# EAGLE design 4ChannelAnalyzer (EAGLE 6.6.0)

## Sheet 1 of 2
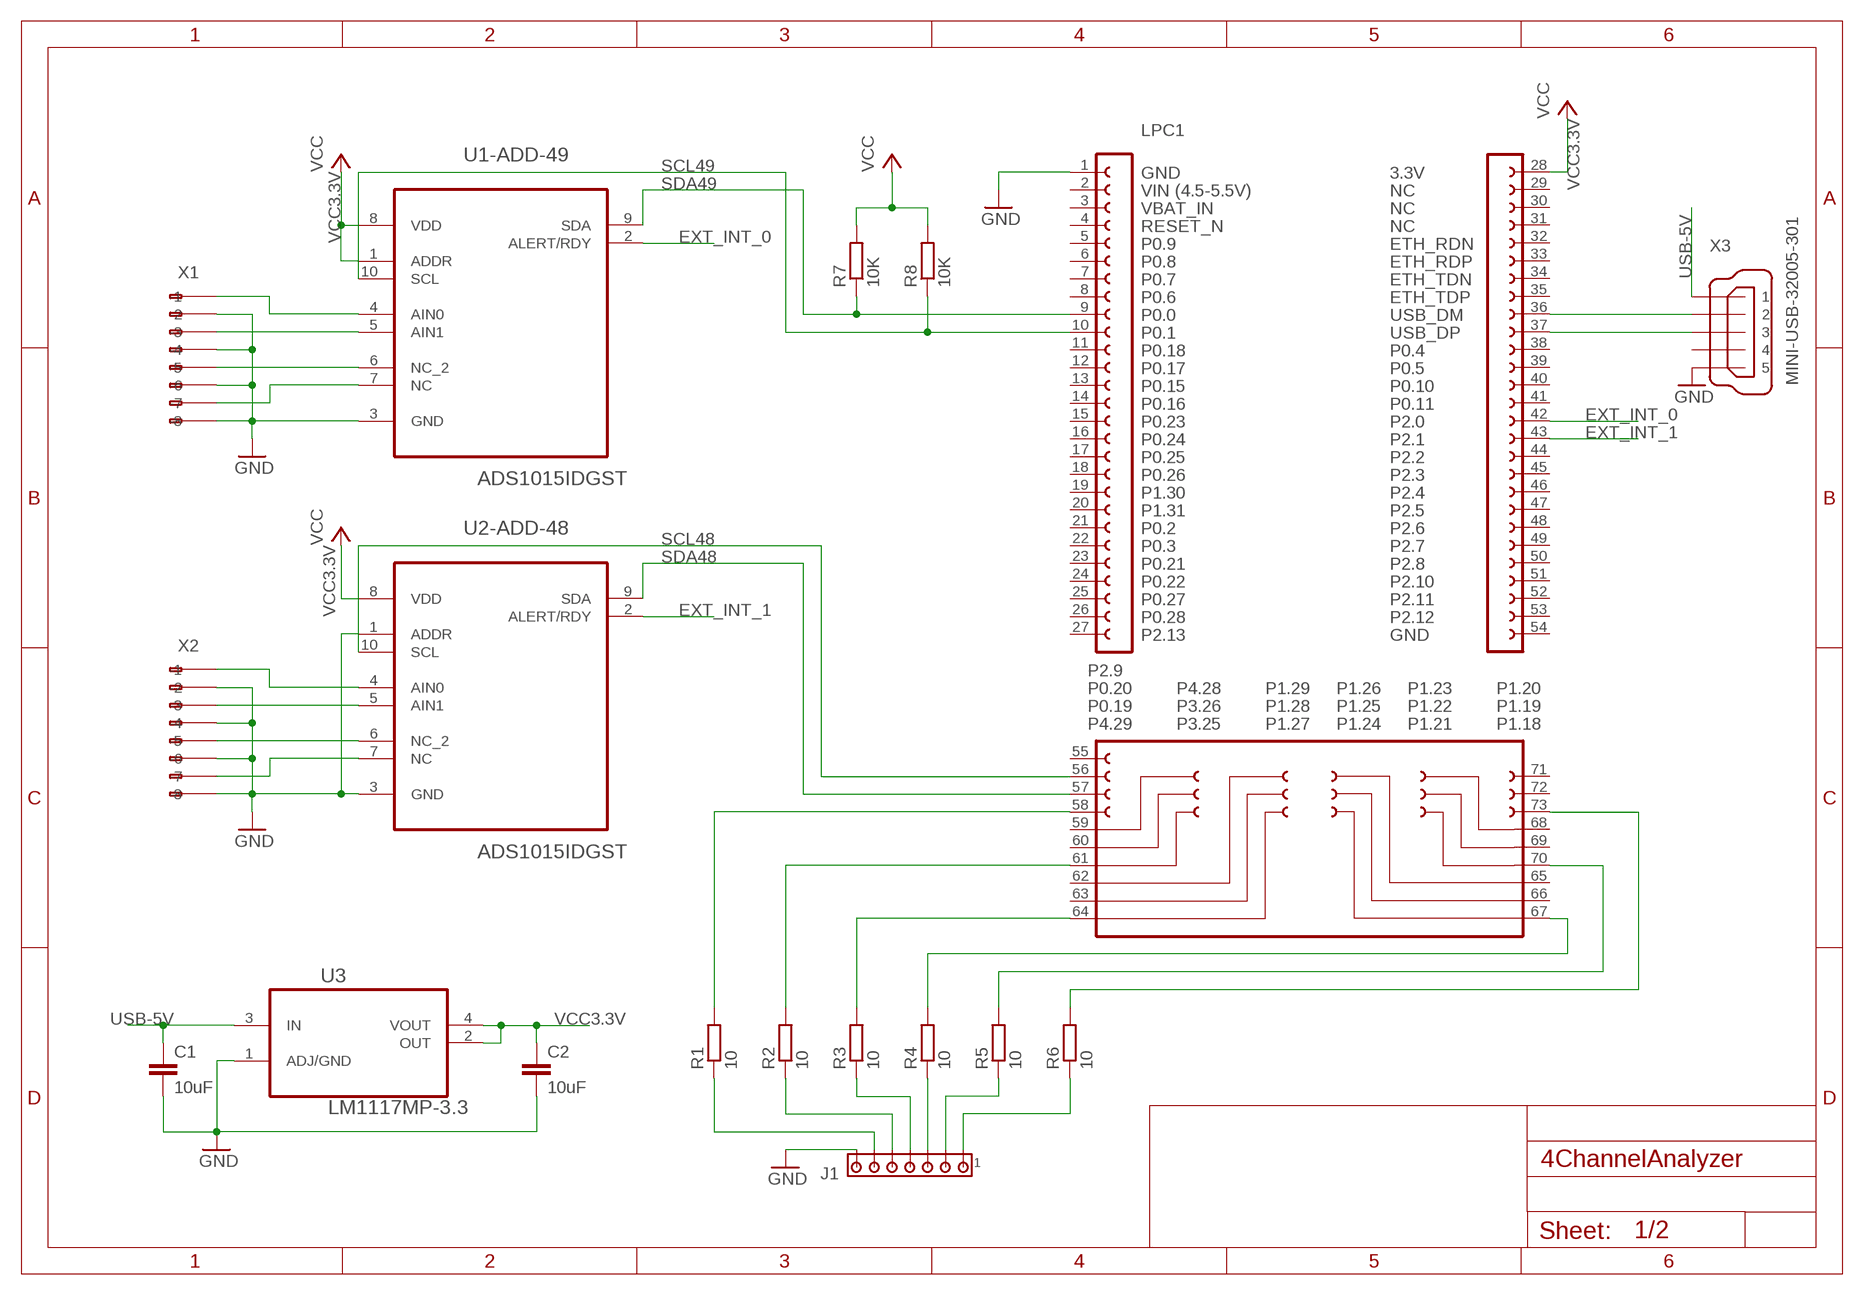
[diagram p0: schematic, sheet 1]

### Parts
C1  10uF  C-EUC0805  [C0805]
C2  10uF  C-EUC0805  [C0805]
J1  MTA07-100  [10X07MTA]
LPC1  LPCXPRESSO_LPC1769  [LPCXPRESSO_LPC1769]
R1  10  R-EU_M2012  [M2012]
R2  10  R-EU_M2012  [M2012]
R3  10  R-EU_M2012  [M2012]
R4  10  R-EU_M2012  [M2012]
R5  10  R-EU_M2012  [M2012]
R6  10  R-EU_M2012  [M2012]
R7  10K  R-EU_M0805  [M0805]
R8  10K  R-EU_M0805  [M0805]
U1-ADD-49  ADS1015IDGST  [SOP50P490X110-10N]
U2-ADD-48  ADS1015IDGST  [SOP50P490X110-10N]
U3  LM1117MP-3.3  [SOT230P696X180-4N]
X1  233-108  [233-108]
X2  233-108  [233-108]
X3  MINI-USB-32005-301  [32005-301]

### Nets
EXT_INT_0: LPC1.42 U1-ADD-49.2(ALERT/RDY)
EXT_INT_1: LPC1.43 U2-ADD-48.2(ALERT/RDY)
GND: C1.2 C2.2 J1.7 LPC1.1 U1-ADD-49.3(GND) U2-ADD-48.1(ADDR) U2-ADD-48.3(GND) U3.1(ADJ/GND) X1.A2(-2) X1.A4(-4) X1.A6(-6) X1.A8(-8) X2.A2(-2) X2.A4(-4) X2.A6(-6) X2.A8(-8) X3.5
N$1: U1-ADD-49.4(AIN0) X1.A1(-1)
N$2: J1.6 R1.1
N$3: J1.5 R2.1
N$4: J1.4 R3.1
N$5: J1.3 R4.1
N$6: J1.2 R5.1
N$7: J1.1 R6.1
N$8: U1-ADD-49.5(AIN1) X1.A3(-3)
N$9: U2-ADD-48.4(AIN0) X2.A1(-1)
N$10: U2-ADD-48.5(AIN1) X2.A3(-3)
N$11: U2-ADD-48.6(NC_2) X2.A5(-5)
N$12: U2-ADD-48.7(NC) X2.A7(-7)
N$13: U1-ADD-49.6(NC_2) X1.A5(-5)
N$14: U1-ADD-49.7(NC) X1.A7(-7)
N$19: LPC1.36 X3.2
N$20: LPC1.37 X3.3
N$21: LPC1.58 R1.2
N$22: LPC1.61 R2.2
N$23: LPC1.64 R3.2
N$24: LPC1.67 R4.2
N$25: LPC1.70 R5.2
N$26: LPC1.73 R6.2
SCL48: LPC1.56 U2-ADD-48.10(SCL)
SCL49: LPC1.10 R8.1 U1-ADD-49.10(SCL)
SDA48: LPC1.57 U2-ADD-48.9(SDA)
SDA49: LPC1.9 R7.1 U1-ADD-49.9(SDA)
USB-5V: C1.1 U3.3(IN) X3.1
VCC3.3V: C2.1 LPC1.28 R7.2 R8.2 U1-ADD-49.1(ADDR) U1-ADD-49.8(VDD) U2-ADD-48.8(VDD) U3.2(OUT) U3.4(VOUT) ; supply symbol labelled VCC
Unconnected: LPC1.2 LPC1.3 LPC1.4 LPC1.5 LPC1.6 LPC1.7 LPC1.8 LPC1.11 LPC1.12 LPC1.13 LPC1.14 LPC1.15 LPC1.16 LPC1.17 LPC1.18 LPC1.19 LPC1.20 LPC1.21 LPC1.22 LPC1.23 LPC1.24 LPC1.25 LPC1.26 LPC1.27 LPC1.29 LPC1.30 LPC1.31 LPC1.32 LPC1.33 LPC1.34 LPC1.35 LPC1.38 LPC1.39 LPC1.40 LPC1.41 LPC1.44 LPC1.45 LPC1.46 LPC1.47 LPC1.48 LPC1.49 LPC1.50 LPC1.51 LPC1.52 LPC1.53 LPC1.54 LPC1.55 LPC1.59 LPC1.60 LPC1.62 LPC1.63 LPC1.65 LPC1.66 LPC1.68 LPC1.69 LPC1.71 LPC1.72 X1.B1(B-1) X1.B2(B-2) X1.B3(B-3) X1.B4(B-4) X1.B5(B-5) X1.B6(B-6) X1.B7(B-7) X1.B8(B-8) X2.B1(B-1) X2.B2(B-2) X2.B3(B-3) X2.B4(B-4) X2.B5(B-5) X2.B6(B-6) X2.B7(B-7) X2.B8(B-8) X3.4

## Sheet 2 of 2
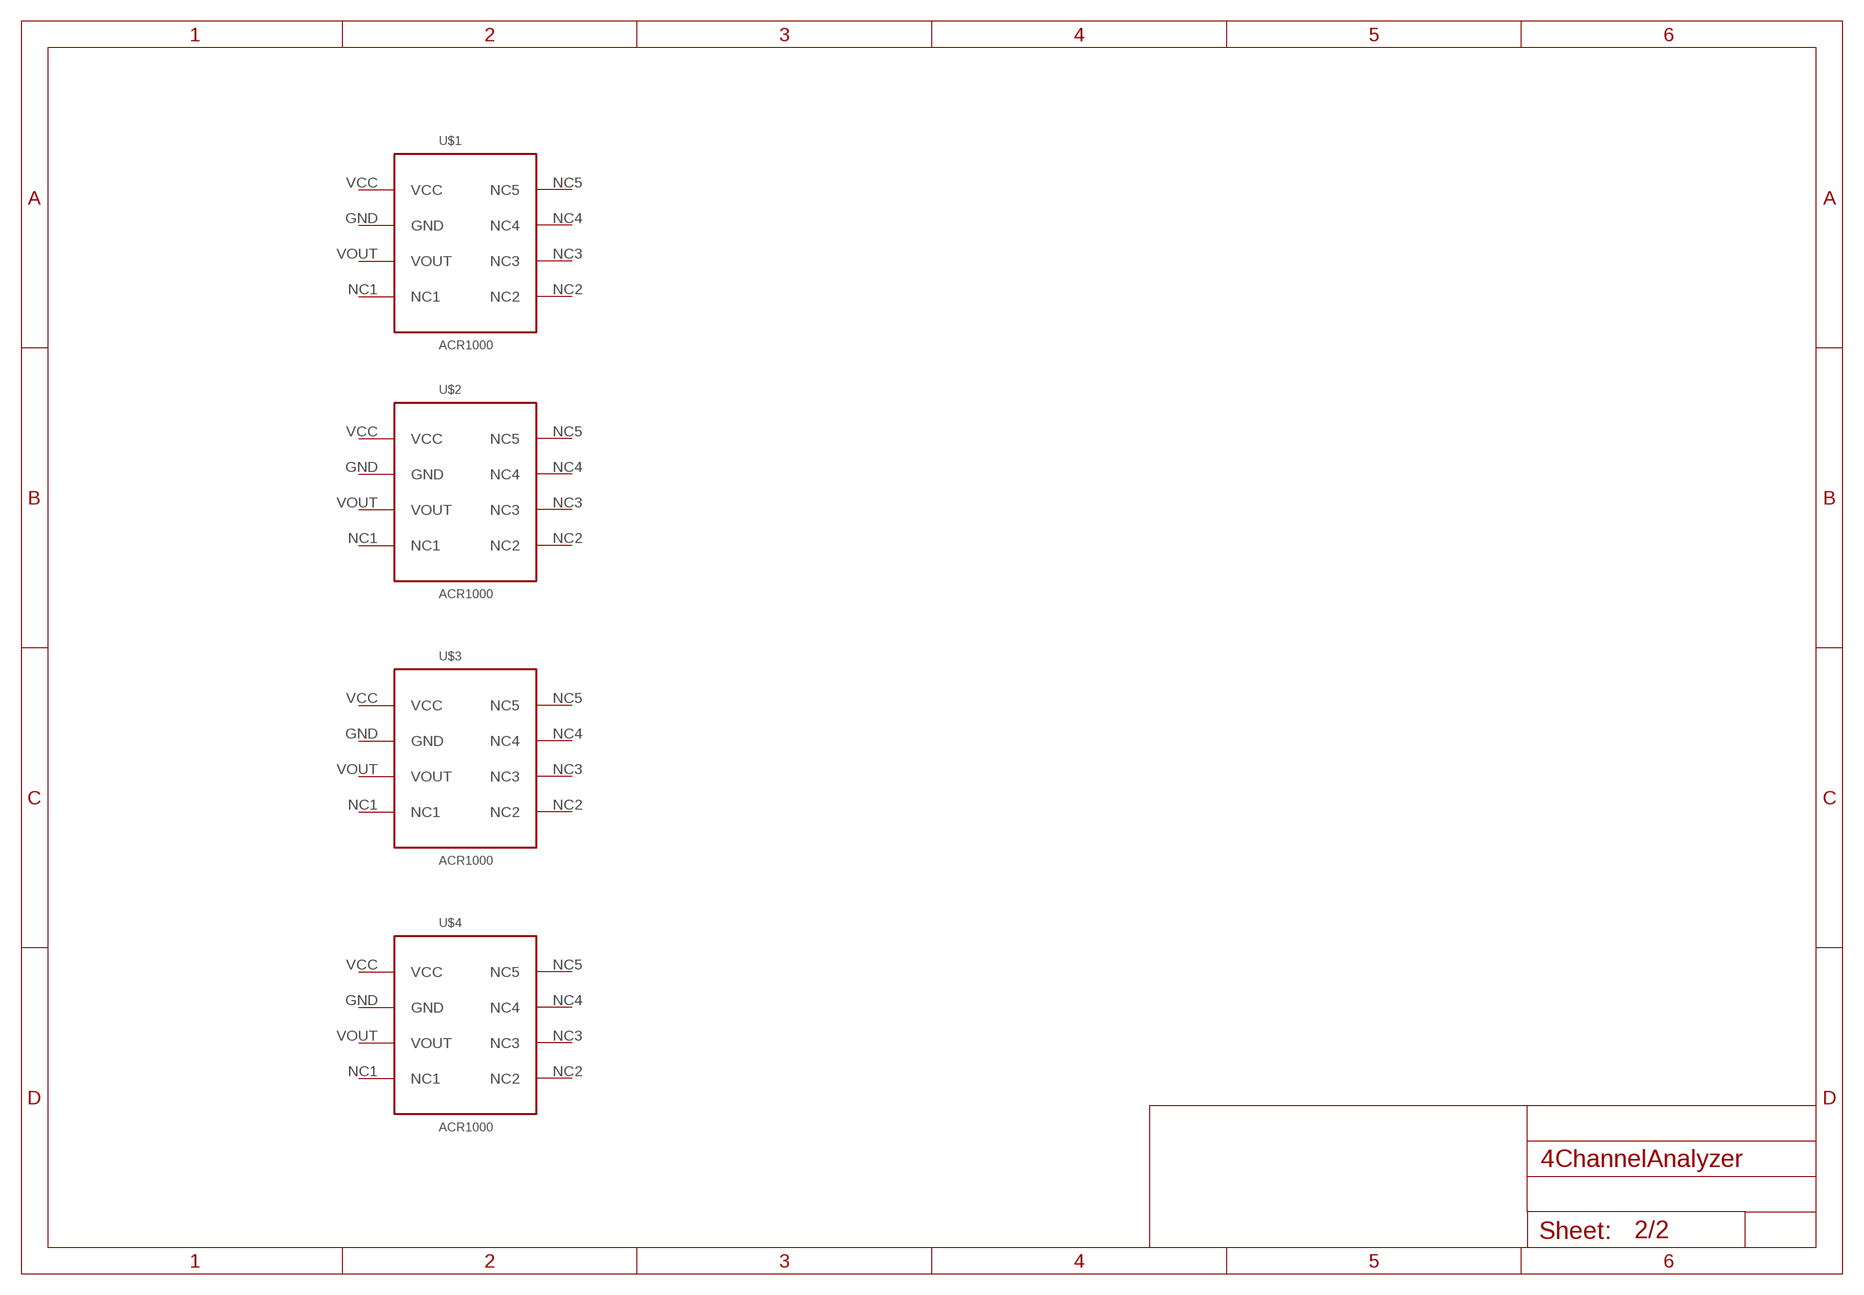
[diagram p1: schematic, sheet 2]

### Parts
U$1  ACR1000  [ACR1000]
U$2  ACR1000  [ACR1000]
U$3  ACR1000  [ACR1000]
U$4  ACR1000  [ACR1000]
Unconnected: U$1.GND U$1.NC1 U$1.NC2 U$1.NC3 U$1.NC4 U$1.NC5 U$1.VCC U$1.VOUT U$2.GND U$2.NC1 U$2.NC2 U$2.NC3 U$2.NC4 U$2.NC5 U$2.VCC U$2.VOUT U$3.GND U$3.NC1 U$3.NC2 U$3.NC3 U$3.NC4 U$3.NC5 U$3.VCC U$3.VOUT U$4.GND U$4.NC1 U$4.NC2 U$4.NC3 U$4.NC4 U$4.NC5 U$4.VCC U$4.VOUT

## Library data of the parts
C1 C2 = rcl:C-EU: CAPACITOR, European symbol
J1 = con-amp:MTA07-100: AMP connector
LPC1 = LPCXpresso_LPC1769:LPCXPRESSO_LPC1769
R1-R8 = rcl:R-EU_: RESISTOR, European symbol
U1-ADD-49 U2-ADD-48 = ADS1015:ADS1015IDGST: Ultra-Small, Low-Power, 12-Bit Analog-to-Digital Converter with Internal Reference; MPN: ADS1015IDGST; OC_FARNELL: 1778211; OC_NEWARK: 35R0211; PACKAGE: MSOP-10; SUPPLIER: Texas Instruments
U3 = LM1117MP-3.3:LM1117MP-3.3: Linear regulators; MPN: LM1117MP-3.3; OC_FARNELL: 9778195; OC_NEWARK: 41K3470; PACKAGE: SOT223-3; SUPPLIER: NationalSemiconductor
U$1-U$4 = ACR1000:ACR1000
X1 X2 = con-wago255:233-108: WAGO; MPN: 233-108; OC_FARNELL: unknown; OC_NEWARK: 28K9050
X3 = con-cypressindustries:MINI-USB-: MINI USB-B Conector Source: www.cypressindustries.com; OC_FARNELL: unknown; OC_NEWARK: unknown

## Board
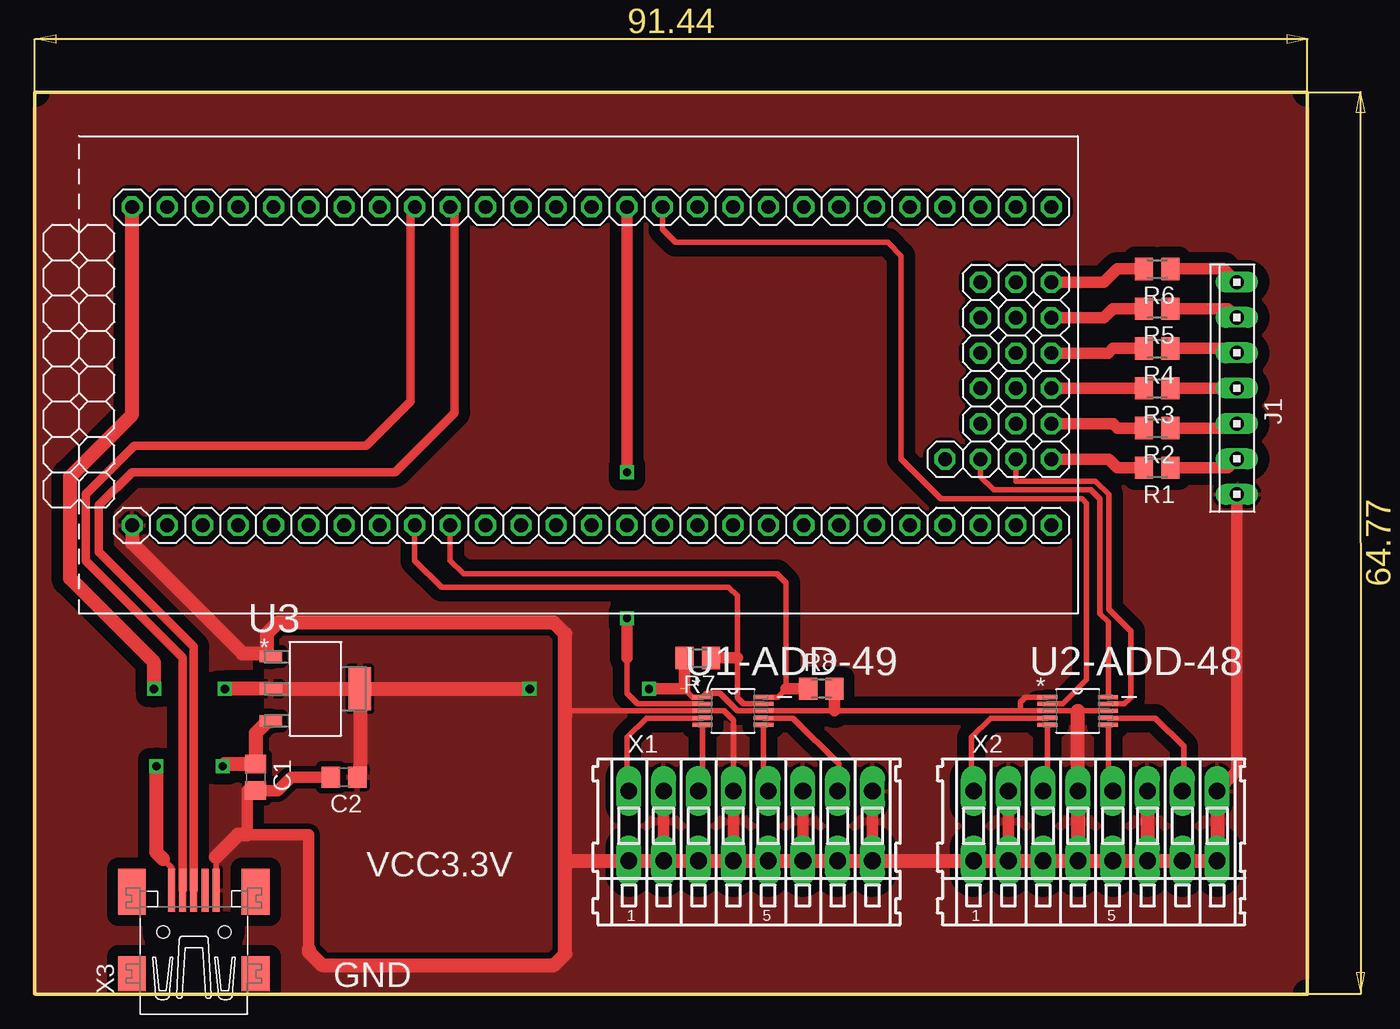
[diagram p2: board, top side]
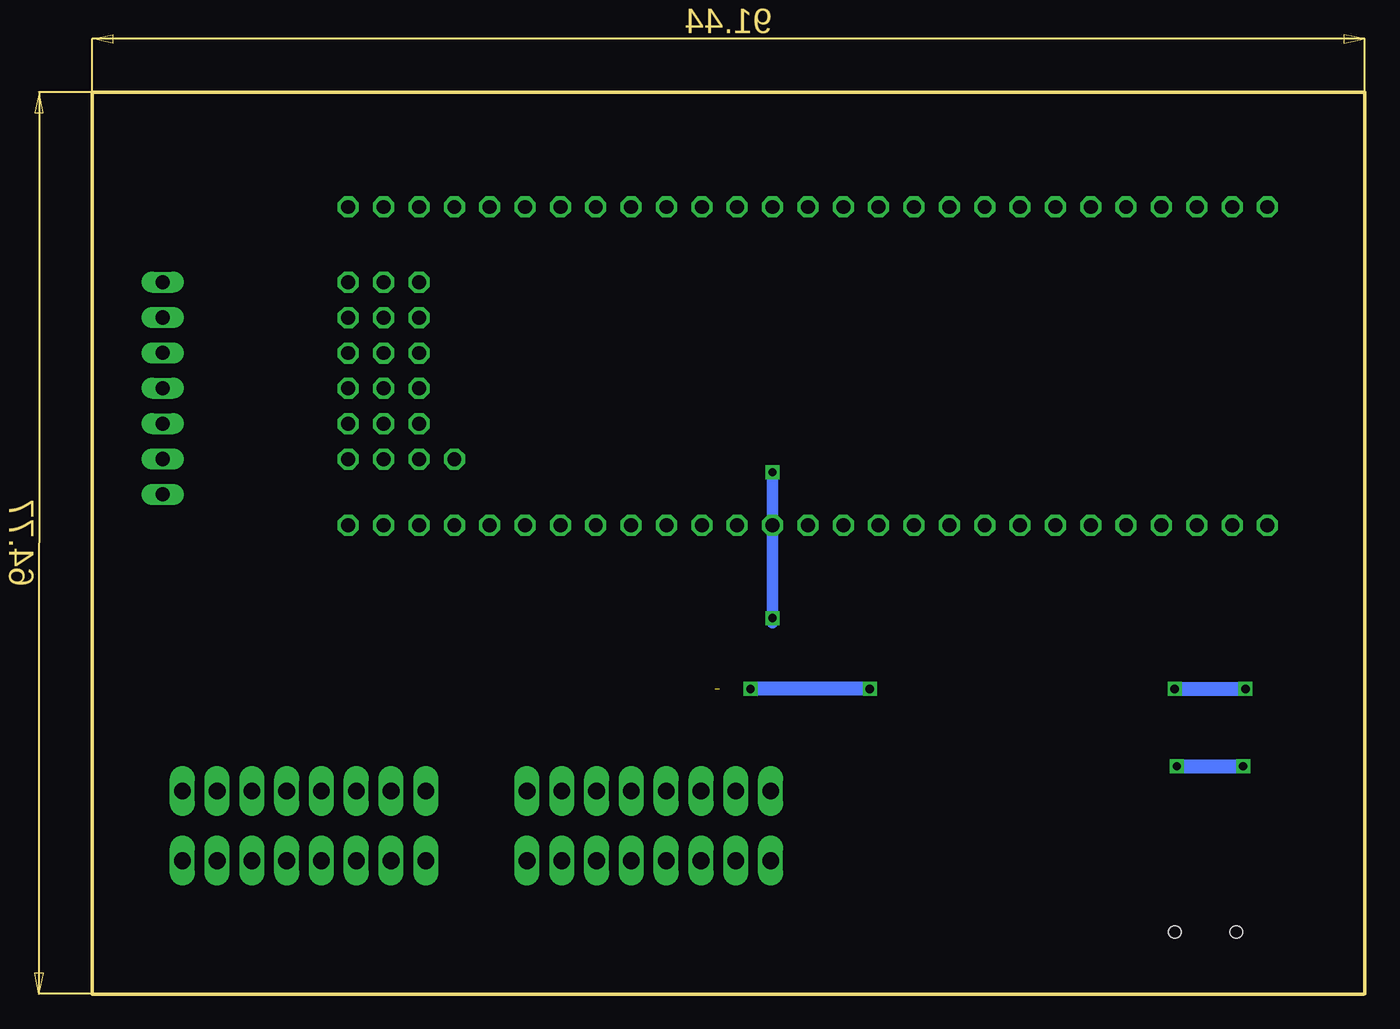
[diagram p3: board, bottom side, seen from below]

Size 95.55 x 68.88 mm. Coordinates in mm from the lower left corner, seen from the top.
Copper layers (1*16): Top 0.035mm / dielectric 1.5mm / Bottom 0.035mm
Design rules "default": minimum track width 10mil, minimum drill 24mil, track to track 8mil, track to pad 8mil, pad to pad 8mil, via to via 8mil, smd to smd 8mil, copper to edge 40mil, drill to drill 8mil, minimum pad ring 10mil, minimum via ring 8mil, stop-mask expansion 4mil, vias tented up to drill 0mil, thermal gap 10mil
Milling: 4 lines

### Footprints (pad centres in the part's own frame; a part is rotated, then mirrored left to right if it is on the bottom)
C0805 = smd 1.3 x 1.5: 1 -0.95,0; 2 0.95,0
10X07MTA = drill 1.016 long: 1 7.62,0; 2 5.08,0; 3 2.54,0; 4 0,0; 5 -2.54,0; 6 -5.08,0; 7 -7.62,0
LPCXPRESSO_LPC1769 = drill 1 octagon: 1 -20.955,-10.795; 2 -18.415,-10.795; 3 -15.875,-10.795; 4 -13.335,-10.795; 5 -10.795,-10.795; 6 -8.255,-10.795; 7 -5.715,-10.795; 8 -3.175,-10.795; 9 -0.635,-10.795; 10 1.905,-10.795; 11 4.445,-10.795; 12 6.985,-10.795; 13 9.525,-10.795; 14 12.065,-10.795; 15 14.605,-10.795; 16 17.145,-10.795; 17 19.685,-10.795; 18 22.225,-10.795; 19 24.765,-10.795; 20 27.305,-10.795; 21 29.845,-10.795; 22 32.385,-10.795; 23 34.925,-10.795; 24 37.465,-10.795; 25 40.005,-10.795; 26 42.545,-10.795; 27 45.085,-10.795; 28 -20.955,12.065; 29 -18.415,12.065; 30 -15.875,12.065; 31 -13.335,12.065; 32 -10.795,12.065; 33 -8.255,12.065; 34 -5.715,12.065; 35 -3.175,12.065; 36 -0.635,12.065; 37 1.905,12.065; 38 4.445,12.065; 39 6.985,12.065; 40 9.525,12.065; 41 12.065,12.065; 42 14.605,12.065; 43 17.145,12.065; 44 19.685,12.065; 45 22.225,12.065; 46 24.765,12.065; 47 27.305,12.065; 48 29.845,12.065; 49 32.385,12.065; 50 34.925,12.065; 51 37.465,12.065; 52 40.005,12.065; 53 42.545,12.065; 54 45.085,12.065; 55 37.465,-6.045; 56 40.005,-6.045; 57 42.545,-6.045; 58 45.085,-6.045; 59 40.005,-3.505; 60 42.545,-3.505; 61 45.085,-3.505; 62 40.005,-0.965; 63 42.545,-0.965; 64 45.085,-0.965; 65 40.005,1.575; 66 42.545,1.575; 67 45.085,1.575; 68 40.005,4.115; 69 42.545,4.115; 70 45.085,4.115; 71 40.005,6.655; 72 42.545,6.655; 73 45.085,6.655
M2012 = smd 1.3 x 1.6: 1 -0.95,0; 2 0.95,0
M0805 = smd 1.3 x 1.6: 1 -0.95,0; 2 0.95,0
SOP50P490X110-10N = smd 1.422 x 0.279: 1 -2.184,0.991; 2 -2.184,0.508; 3 -2.184,0; 4 -2.184,-0.508; 5 -2.184,-0.991; 6 2.184,-0.991; 7 2.184,-0.508; 8 2.184,0; 9 2.184,0.508; 10 2.184,0.991
SOT230P696X180-4N = smd 1.6 x 0.838: 1 -3.2,2.311; 2 -3.2,0; 3 -3.2,-2.311 | smd 1.6 x 3.099: 4 3.2,0
ACR1000 = drill 0.9 pad 1.676 square: GND -7.5,1.25; NC1 -7.5,-3.75; NC2 7.5,-3.75; NC3 7.5,-1.25; NC4 7.5,1.25; NC5 7.5,3.75; VCC -7.5,3.75; VOUT -7.5,-1.25
233-108 = drill 1.2 long: A1 -8.75,2.5; A2 -6.25,2.5; A3 -3.75,2.5; A4 -1.25,2.5; A5 1.25,2.5; A6 3.75,2.5; A7 6.25,2.5; A8 8.75,2.5; B1 -8.75,-2.5; B2 -6.25,-2.5; B3 -3.75,-2.5; B4 -1.25,-2.5; B5 1.25,-2.5; B6 3.75,-2.5; B7 6.25,-2.5; B8 8.75,-2.5
32005-301 = smd 3.1 x 0.5: 1 3,1.6; 2 3,0.8; 3 3,0; 4 3,-0.8; 5 3,-1.6 | smd 2.5 x 2: M1 -3,-4.45; M2 -3,4.45 | smd 3.3 x 2: M3 2.9,4.45; M4 2.9,-4.45 | hole 0.9: 0,2.2; 0,-2.2

### Placement (x,y rotation side)
C1  15.88,15.56 270 top
C2  22.23,15.56 180 top
J1  86.36,43.5 90 top
LPC1  27.94,44.45 0 top
R1  80.64,37.78 180 top
R2  80.64,40.64 180 top
R3  80.64,43.5 180 top
R4  80.64,46.35 180 top
R5  80.64,49.21 180 top
R6  80.64,52.07 180 top
R7  47.62,24.13 180 top
R8  56.52,21.91 0 top
U1-ADD-49  50.16,20.32 0 top
U2-ADD-48  74.93,20.32 0 top
U3  20.16,21.91 0 top
U$1  19.68,88.9 90 top  (outside the outline)
U$2  38.1,88.9 90 top  (outside the outline)
U$3  56.52,88.9 90 top  (outside the outline)
U$4  74.93,88.9 90 top  (outside the outline)
X1  51.44,12.06 0 top
X2  76.2,12.06 0 top
X3  11.43,4.45 90 top

### Tracks (layer width: path | path; a pad name or v marks a point on that pad's centre or on a via)
EXT_INT_0  (via drill 0.6)
  Top 0.406: U1-ADD-49.2 43.31,20.83 42.55,21.59 42.55,24.13
  Top 0.813: 42.55,24.13 v42.55,26.99 | v42.55,37.47 LPC1.42
  Bottom 0.813: 42.55,26.67 v42.55,26.99 v42.55,37.47
EXT_INT_1
  Top 0.406: U2-ADD-48.2 73.85,20.83 75.56,22.54 75.56,35.24 75.25,35.56 65.09,35.56 62.23,38.42 62.23,53.02 61.28,53.98 46.04,53.98 45.09,54.93 LPC1.43
GND
  Top 0.406: 73.66,20.32 U2-ADD-48.3 | X1.A4 50.19,19.66 49.53,20.32 U1-ADD-49.3 38.42,20.32 38.1,20 | X3.5 13.03,9.83 13.02,9.84 | 74.93,20.32 U2-ADD-48.3 | U2-ADD-48.1 71.16,21.31 70.8,20.95 70.8,20.32 U2-ADD-48.3
  Top 0.813: C2.2 18.41,15.56 17.46,14.61 C1.2 15.24,14.61 15.24,11.43 19.68,11.43 19.68,3.17 | X2.A2 69.95,9.53 69.85,9.53 | X1.A8 60.19,9.53 59.69,9.53 | X1.A6 55.19,9.53 54.93,9.53 | X1.A4 50.19,9.53 50.16,9.53 | X1.A2 45.19,9.53 45.4,9.53 | J1.7 86.36,15.97 X2.A8
  Top 1.016: 19.68,3.17 19.68,3.02 20.64,2.06 37.31,2.06 38.1,2.86 38.1,9.21 | 38.1,9.21 38.1,20 38.1,25.88 37.31,26.67 17.46,26.67 16.67,25.88 16.67,24.51 U3.1 16.73,24.45 14.92,24.45 6.99,32.38 LPC1.1 | 15.24,11.43 14.61,11.43 13.02,9.84 | X2.A8 84.95,9.66 85.09,9.53 79.69,9.53 | 79.69,9.53 74.93,9.53 | 74.93,9.53 69.85,9.53 59.69,9.53 54.93,9.53 50.16,9.53 45.4,9.53 38.42,9.53 38.1,9.21 | X2.A6 79.95,9.78 79.69,9.53 | 74.93,9.53 74.95,9.54 X2.A4 74.95,20.3 74.93,20.32
  pour Top (isolate 0.813, rank 4): 0,64.77 91.44,64.77 91.44,0.32 91.44,0 0,0
N$1
  Top 0.406: U1-ADD-49.4 43.94,19.81 42.55,18.41 42.55,14.71 X1.A1
N$2
  Top 0.813: R1.1 85.72,37.78 J1.6
N$3
  Top 0.813: R2.1 86.04,40.64 J1.5
N$4
  Top 0.813: R3.1 J1.4
N$5
  Top 0.813: R4.1 86.04,46.35 J1.3
N$6
  Top 0.813: R5.1 85.72,49.21 J1.2
N$7
  Top 0.813: R6.1 85.41,52.07 J1.1
N$8
  Top 0.406: U1-ADD-49.5 47.98,14.86 X1.A3
N$9
  Top 0.406: U2-ADD-48.4 68.71,19.81 67.31,18.41 67.31,14.71 X2.A1
N$10
  Top 0.406: U2-ADD-48.5 72.75,14.86 X2.A3
N$11
  Top 0.406: U2-ADD-48.6 77.11,14.9 X2.A5
N$12
  Top 0.406: U2-ADD-48.7 80.52,19.81 82.55,17.78 82.55,14.66 X2.A7
N$13
  Top 0.406: U1-ADD-49.6 52.35,14.9 X1.A5
N$14
  Top 0.406: U1-ADD-49.7 54.48,19.81 57.78,16.51 57.78,14.66 X1.A7
N$19
  Top 0.61: X3.2 10.63,24.14 3.65,31.11 3.65,35.88 7.14,39.37 23.81,39.37 26.99,42.55 26.99,56.2 LPC1.36
N$20
  Top 0.61: X3.3 11.43,24.92 4.6,31.75 4.6,35.08 6.99,37.47 25.88,37.47 30.16,41.75 30.16,56.2 LPC1.37
N$21
  Top 0.813: LPC1.58 77.17,38.41 77.79,37.78 R1.2
N$22
  Top 0.813: LPC1.61 77.48,40.95 77.79,40.64 R2.2
N$23
  Top 0.813: LPC1.64 79.68,43.48 R3.2
N$24
  Top 0.813: LPC1.67 77.14,46.02 77.47,46.35 R4.2
N$25
  Top 0.813: LPC1.70 76.82,48.56 77.47,49.21 R5.2
N$26
  Top 0.813: LPC1.73 76.82,51.1 77.79,52.07 R6.2
SCL48
  Top 0.406: U2-ADD-48.10 77.11,26.71 76.52,27.3 76.52,35.56 75.88,36.2 68.9,36.2 67.94,37.15 LPC1.56
SCL49
  Top 0.406: U1-ADD-49.10 53.38,21.31 53.98,21.91 53.98,24.77 53.98,29.53 53.34,30.16 30.8,30.16 29.84,31.11 LPC1.10
  Top 0.813: R8.1 53.98,21.91
SDA48
  Top 0.406: U2-ADD-48.9 78.3,20.83 78.74,21.27 78.74,26.04 77.15,27.62 77.15,35.88 76.2,36.83 70.48,36.83 LPC1.57
SDA49
  Top 0.406: U1-ADD-49.9 50.93,20.83 50.48,21.27 50.48,24.13 50.48,28.57 49.85,29.21 29.21,29.21 27.3,31.11 LPC1.9
  Top 0.813: R7.1 50.48,24.13
USB-5V  (via drill 0.6)
  Top 0.406: 9.84,7.45 X3.1 9.83,9.06 9.21,9.68
  Top 1.016: U3.3 16.74,19.6 15.88,18.73 C1.1 13.65,16.51 v13.49,16.35 | v8.73,16.35 8.73,10.16 9.21,9.68
  Bottom 1.016: v13.49,16.35 v8.73,16.35
VCC3.3V  (via drill 0.6)  (1 unrouted)
  Top 0.406: 46.67,21.91 47.27,21.31 U1-ADD-49.1 48.26,21.59 49.21,21.59 50.48,20.32 U1-ADD-49.8 57.47,20.32 U2-ADD-48.8
  Top 0.813: v44.13,21.91 46.35,21.91 46.67,21.91 R7.2 | R8.2 57.47,20.32
  Top 1.016: U3.4 U3.2 v13.65,21.91 | U3.4 23.36,15.74 C2.1 | v8.57,21.91 8.57,23.81 2.54,29.84 2.54,37.15 6.99,41.59 LPC1.28 | U3.4 v35.56,21.91
  Bottom 1.016: v13.65,21.91 v8.57,21.91 | v35.56,21.91 v44.13,21.91
  pour Top (isolate 0.406, rank 3): 37.31,26.67 16.67,26.67 16.67,11.59 19.84,11.59 19.84,2.06 37.31,2.06

### Text on the board
tNames: VCC3.3V | GND
Name: Sensors Connectors